# Altium schematic sheet TOP.SchDoc: =DocumentName
size A4; Organization: Queen's Formula SAE; Address1: 130 Stuart St, Kingston; Address2: Ontario; Address3: Canada; Address4: K7L 2V9; DocumentNumber: 1; Revision: 0; SheetNumber: 1; SheetTotal: 1
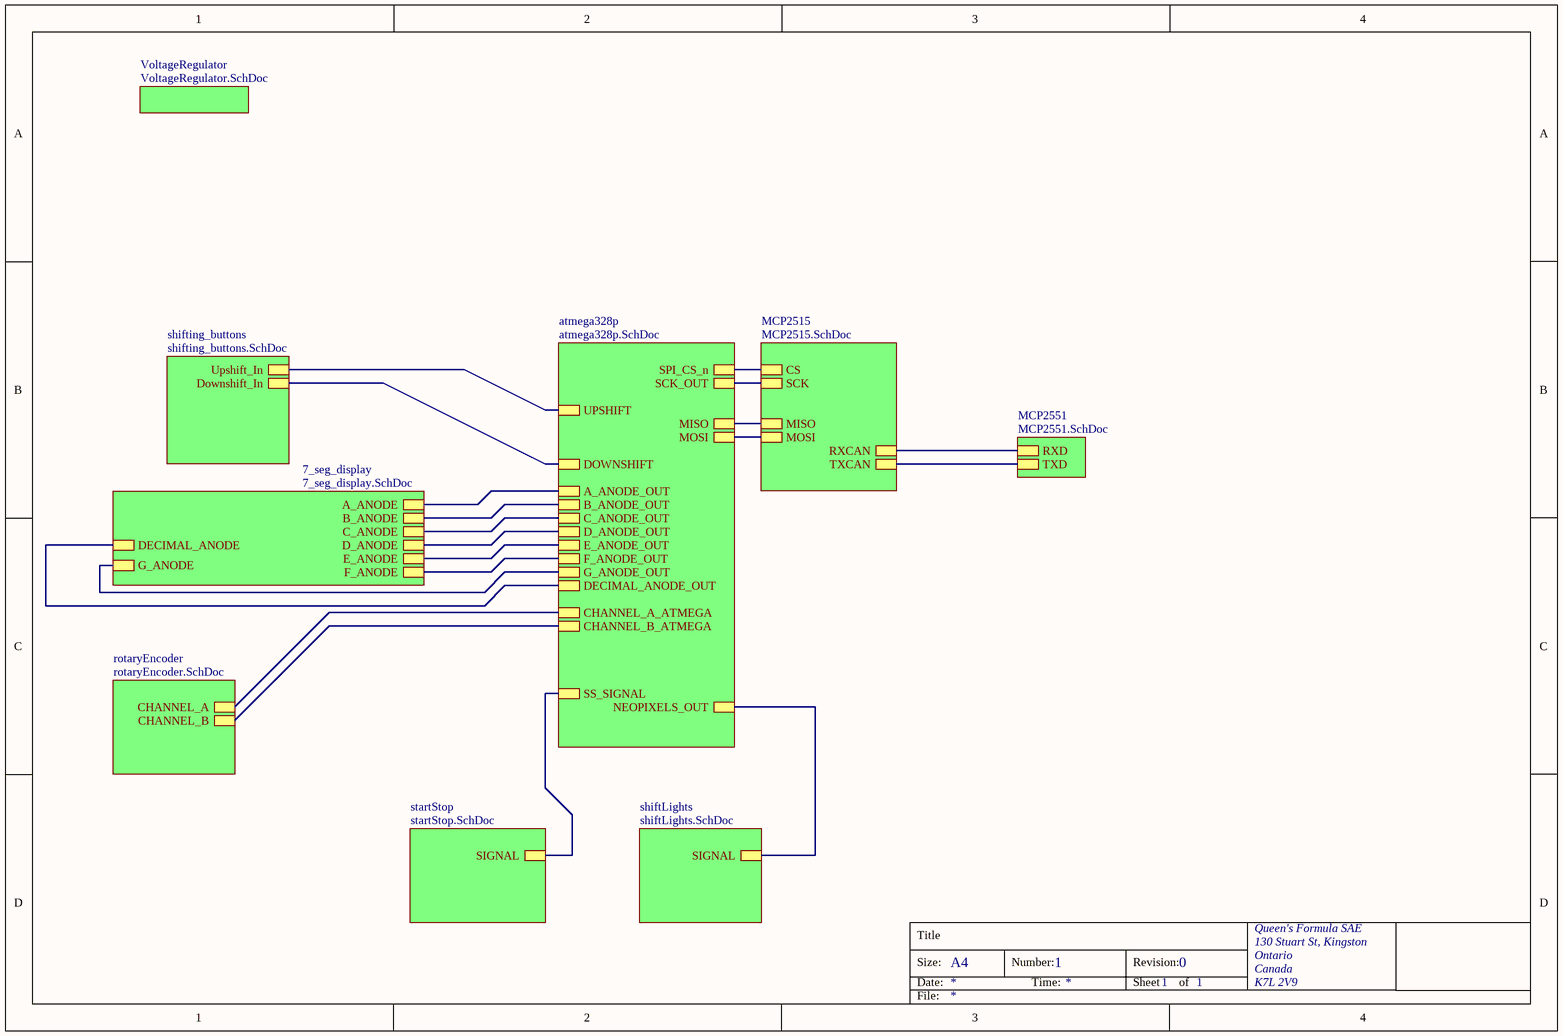
[diagram p0: TOP.SchDoc]

## Sub-sheets
7_seg_display = 7_seg_display.SchDoc: A_ANODE, B_ANODE, C_ANODE, D_ANODE, E_ANODE, F_ANODE, G_ANODE, DECIMAL_ANODE
atmega328p = atmega328p.SchDoc: SPI_CS_n, UPSHIFT, MOSI, MISO, SCK_OUT, DOWNSHIFT, CHANNEL_A_ATMEGA, CHANNEL_B_ATMEGA, NEOPIXELS_OUT, A_ANODE_OUT, B_ANODE_OUT, C_ANODE_OUT, D_ANODE_OUT, E_ANODE_OUT, F_ANODE_OUT, G_ANODE_OUT, DECIMAL_ANODE_OUT, SS_SIGNAL
MCP2515 = MCP2515.SchDoc: MOSI, MISO, CS, SCK, TXCAN, RXCAN
MCP2551 = MCP2551.SchDoc: RXD, TXD
rotaryEncoder = rotaryEncoder.SchDoc: CHANNEL_A, CHANNEL_B
shifting_buttons = shifting_buttons.SchDoc: Upshift_In, Downshift_In
shiftLights = shiftLights.SchDoc: SIGNAL
startStop = startStop.SchDoc: SIGNAL
VoltageRegulator = VoltageRegulator.SchDoc: no entries

## Nets
(unnamed): sheet atmega328p/SPI_CS_n, sheet MCP2515/CS
(unnamed): sheet atmega328p/UPSHIFT, sheet shifting_buttons/Upshift_In
(unnamed): sheet atmega328p/MOSI, sheet MCP2515/MOSI
(unnamed): sheet atmega328p/MISO, sheet MCP2515/MISO
(unnamed): sheet atmega328p/SCK_OUT, sheet MCP2515/SCK
(unnamed): sheet atmega328p/DOWNSHIFT, sheet shifting_buttons/Downshift_In
(unnamed): sheet atmega328p/CHANNEL_A_ATMEGA, sheet rotaryEncoder/CHANNEL_A
(unnamed): sheet atmega328p/CHANNEL_B_ATMEGA, sheet rotaryEncoder/CHANNEL_B
(unnamed): sheet atmega328p/NEOPIXELS_OUT, sheet shiftLights/SIGNAL
(unnamed): sheet atmega328p/A_ANODE_OUT, sheet 7_seg_display/A_ANODE
(unnamed): sheet atmega328p/B_ANODE_OUT, sheet 7_seg_display/B_ANODE
(unnamed): sheet atmega328p/C_ANODE_OUT, sheet 7_seg_display/C_ANODE
(unnamed): sheet atmega328p/D_ANODE_OUT, sheet 7_seg_display/D_ANODE
(unnamed): sheet atmega328p/E_ANODE_OUT, sheet 7_seg_display/E_ANODE
(unnamed): sheet atmega328p/F_ANODE_OUT, sheet 7_seg_display/F_ANODE
(unnamed): sheet atmega328p/G_ANODE_OUT, sheet 7_seg_display/G_ANODE
(unnamed): sheet atmega328p/DECIMAL_ANODE_OUT, sheet 7_seg_display/DECIMAL_ANODE
(unnamed): sheet atmega328p/SS_SIGNAL, sheet startStop/SIGNAL
(unnamed): sheet MCP2515/TXCAN, sheet MCP2551/TXD
(unnamed): sheet MCP2515/RXCAN, sheet MCP2551/RXD

## Notes on the sheet
- Title
- Size:
- Date:
- A4
- Number:
- Time:
- Revision:
- Sheet
- of
- File: